# Altium schematic sheet Audio.SchDoc
size A3; Date: 27.05.2014; DrawnBy: luths8; Organization: BFH; Address1: Bern University of Applied Sciences; Address2: Engineering and Information Technology; Address3: Jlcoweg 1; Address4: CH-3400 Burgdorf; DocumentNumber: 1; Revision: 1.0; SheetNumber: 12; SheetTotal: 19; CurrentDate: 27.05.2014
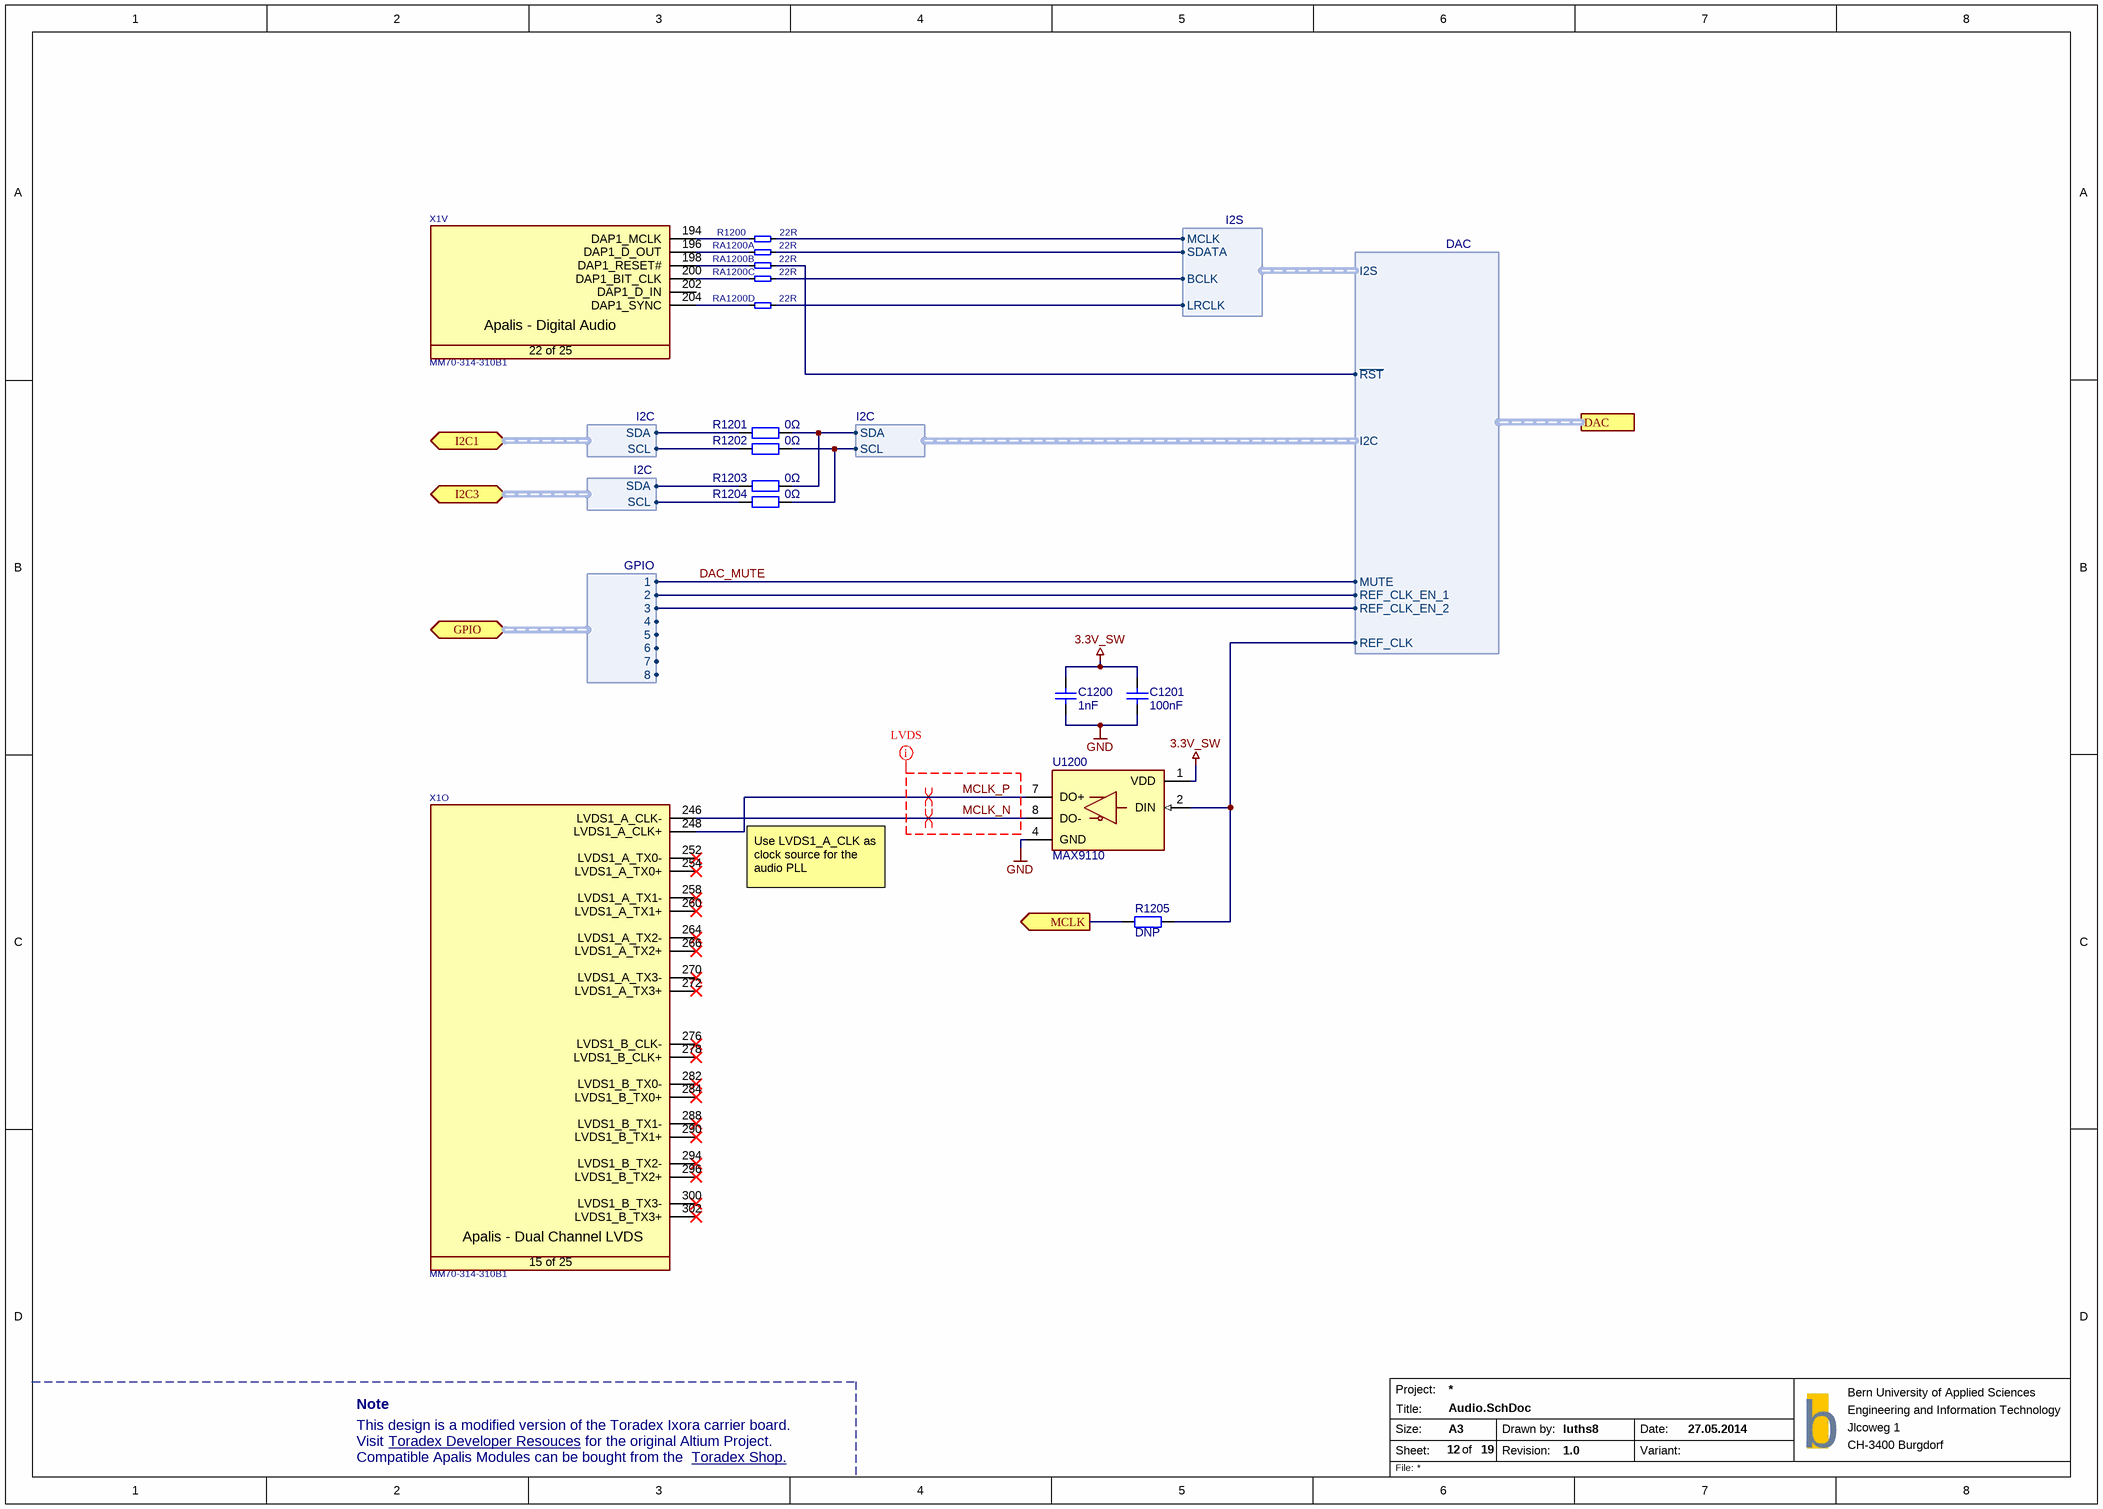
[diagram p0: Audio.SchDoc]

## Parts
C1200  1nF  [SMD0603CAP]
C1201  100nF  [SMD0603CAP]
R1200  22R  [SMD0603RES]
R1201  0Ω  [SMD0603RES]
R1202  0Ω  [SMD0603RES]
R1203  0Ω  [SMD0603RES]
R1204  0Ω  [SMD0603RES]
R1205  DNP  [SMD0603RES]
RA1200  22R  [T_Resistor_Array_X4]  (parts A,B,C,D of 4)
U1200  MAX9110  [SOIC8]
X1  Manufacturer Part No.: MM70-314-310B1  [T_JAE_MM70-314-310B1]  (hidden comment: CON-JAE-MM70-314-310B1-314-0.5mm)  (parts O,V of 25)

## Ports
DAC (harness DAC), GPIO (bidir, harness GPIO, see 12, 17, 19, 5), I2C1 (bidir, harness I2C, see 12, 17, 19, 5), I2C3 (bidir, harness I2C, see 12, 17, 19, 5), MCLK (out)

## Harnesses
I2S: MCLK, BCLK, LRCLK, SDATA
DAC: I2S, ~{RST}, I2C, MUTE, REF_CLK_EN_1, REF_CLK_EN_2, REF_CLK
I2C: SCL, SDA
GPIO: 1, 2, 3, 4, 5, 6, 7, 8

## Nets
3.3V_SW: C1200.1 C1201.1 U1200.1(VDD)
GND: C1200.2(q) C1201.2(q) U1200.4(GND)
DAC_MUTE: port DAC.MUTE, port GPIO.1
MCLK: R1205.2 ; port MCLK
MCLK_N: U1200.8(DO-) X1.246(LVDS1_A_CLK-)
MCLK_P: U1200.7(DO+) X1.248(LVDS1_A_CLK+)
NetR1200_1: R1200.1 X1.194(DAP1_MCLK)
NetR1200_2: R1200.2 ; harness I2S.MCLK
NetR1201_1: R1201.1 R1203.1 ; harness I2C.SDA
NetR1201_2: R1201.2 ; port I2C1.SDA
NetR1202_1: R1202.1 R1204.1 ; harness I2C.SCL
NetR1202_2: R1202.2 ; port I2C1.SCL
NetR1203_2: R1203.2 ; port I2C3.SDA
NetR1204_2: R1204.2 ; port I2C3.SCL
NetR1205_1: R1205.1 U1200.2(DIN) ; port DAC.REF_CLK
NetRA1200_1: RA1200.1 X1.196(DAP1_D_OUT)
NetRA1200_2: RA1200.2 X1.198(DAP1_RESET#)
NetRA1200_3: RA1200.3 X1.200(DAP1_BIT_CLK)
NetRA1200_4: RA1200.4 X1.204(DAP1_SYNC)
NetRA1200_5: RA1200.5 ; harness I2S.SDATA
NetRA1200_6: RA1200.6 ; port DAC.~{RST}
NetRA1200_7: RA1200.7 ; harness I2S.BCLK
NetRA1200_8: RA1200.8 ; harness I2S.LRCLK
(unnamed): port DAC.REF_CLK_EN_1, port GPIO.2
(unnamed): port DAC.REF_CLK_EN_2, port GPIO.3

Not connected (* = marked no-connect by the designer): X1 202(DAP1_D_IN) 252(LVDS1_A_TX0-)* 254(LVDS1_A_TX0+)* 258(LVDS1_A_TX1-)* 260(LVDS1_A_TX1+)* 264(LVDS1_A_TX2-)* 266(LVDS1_A_TX2+)* 270(LVDS1_A_TX3-)* 272(LVDS1_A_TX3+)* 276(LVDS1_B_CLK-)* 278(LVDS1_B_CLK+)* 282(LVDS1_B_TX0-)* 284(LVDS1_B_TX0+)* 288(LVDS1_B_TX1-)* 290(LVDS1_B_TX1+)* 294(LVDS1_B_TX2-)* 296(LVDS1_B_TX2+)* 300(LVDS1_B_TX3-)* 302(LVDS1_B_TX3+)*

## Layout directives
differential pair: MCLK_N, MCLK_P
net class LVDS: MCLK_N, MCLK_P

## Notes on the sheet
- Use LVDS1_A_CLK as clock source for the audio PLL
- Note
- This design is a modified version of the Toradex Ixora carrier board.
- Visit
- Compatible Apalis Modules can be bought from the
- Toradex Developer Resouces <https://developer.toradex.com/products/ixora-carrier-board>
- for the original Altium Project.
- Toradex Shop. <https://www.toradex.com/order-now/apalis-arm-family>
- Project:
- Size:
- Sheet:
- Title:
- A3
- of
- Drawn by:
- Revision:
- Date:
- Variant:
- b
- File:
- (in symbol CON-JAE-MM70-314-310B1-314-0.5mm, part O) Apalis - Dual Channel LVDS; 15 of 25
- (in symbol CON-JAE-MM70-314-310B1-314-0.5mm, part V) Apalis - Digital Audio; 22 of 25

## Library data of the parts
C1200 C1201 = Capacitor Ceramic: Ceramic Capacitor; Voltage: *; Manufacturer Part No.: *
R1200 = R-22R-63mW-5%-0402: Resistor 22 ohm 63mW 5% 0603; Rating: 63mW; Tolerance: 5%; Value: 22R
R1201-R1205 = Resistor: Manufacturer Part No.: *
RA1200 = RA-22R-63mW-5%-1206-div: Resistor Array 22 R 63mW 5% 1206; Tolerance: 5%; Power Dissipation: 63mW; Value: 22R
U1200 = MAX9110: LVDS Transmitter; Manufacturer Part No.: MAX9110ESA+
X1 = CON-JAE-MM70-314-310B1-314-0.5mm: MXM3 Connector; Manufacturer Name: JAE; No. of ways: 314